# Altium project ov_ftdi.PrjPcb
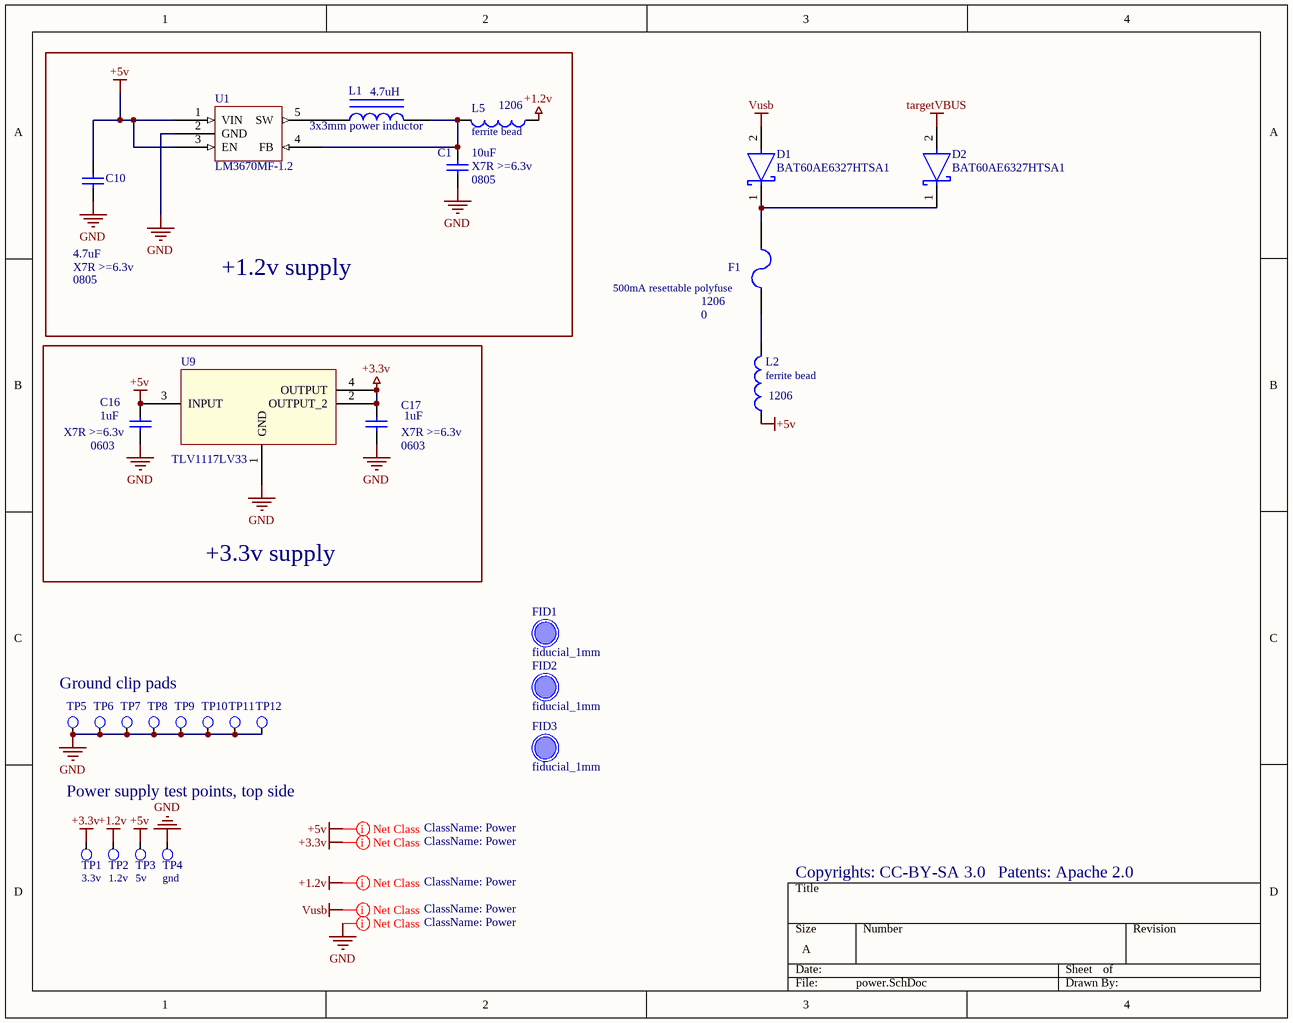
[diagram p0: power.SchDoc]
VersionRevision: v3.4; ProjectName: OpenVizsla
5 sheets, 167 parts. Net scope: global (net labels, ports and power ports of the same name join across sheets).
Board file: ov_ftdi.PcbDoc
Sheets:
  power.SchDoc
  FPGA power v3.SchDoc
  RAM and target USB.SchDoc
  fpga.SchDoc
  usb.SchDoc

## Sheet power.SchDoc
size A; DocumentNumber: 1; SheetNumber: 1; SheetTotal: 6

### Parts
C1  value 10uF  PackageReference: 0805  Rating: X7R >=6.3v  [CAPC2012N]  (hidden comment: Cap Semi)
C10  value 4.7uF  PackageReference: 0805  Rating: X7R >=6.3v  [CAPC2012N]  (hidden comment: Cap Semi)
C16  value 1uF  PackageReference: 0603  Rating: X7R >=6.3v  [CAPC1608N]  (hidden comment: Cap Semi)
C17  value 1uF  PackageReference: 0603  Rating: X7R >=6.3v  [CAPC1608N]  (hidden comment: Cap Semi)
D1  BAT60AE6327HTSA1  [FP-PG-SOD323-2-IPC_C]
D2  BAT60AE6327HTSA1  [FP-PG-SOD323-2-IPC_C]
F1  500mA resettable polyfuse  value 0  PackageReference: 1206  [RESC3216N]
FID1  fiducial_1mm  [Fiducial_1mm]
FID2  fiducial_1mm  [Fiducial_1mm]
FID3  fiducial_1mm  [Fiducial_1mm]
L1  3x3mm power inductor  value 4.7uH  [3x3mm inductor]
L2  ferrite bead  PackageReference: 1206  [INDC3216AN]
L5  ferrite bead  PackageReference: 1206  [INDC3216N]
TP1  3.3v  [testpoint-60mil]  (no BOM)
TP2  1.2v  [testpoint-60mil]  (no BOM)
TP3  5v  [testpoint-60mil]  (no BOM)
TP4  gnd  [testpoint-60mil]  (no BOM)
TP5  (no value)  [ground pad]  (no BOM)
TP6  (no value)  [ground pad]  (no BOM)
TP7  (no value)  [ground pad]  (no BOM)
TP8  (no value)  [ground pad]  (no BOM)
TP9  (no value)  [ground pad]  (no BOM)
TP10  (no value)  [ground pad]  (no BOM)
TP11  (no value)  [ground pad]  (no BOM)
TP12  (no value)  [ground pad]  (no BOM)
U1  value LM3670MF-1.2  [SOT23-5AN]  (hidden comment: LM3670MF-1.2/NOPB)
U9  TLV1117LV33  [DCY4]

### Blocks framed on the sheet
+1.2v supply: C1 C10 L1 L5 U1
+3.3v supply: C16 C17 U9

### Nets
+1.2v: L5.1 TP2.1(pin)
+3.3v: C17.2 TP1.1(pin) U9.2(OUTPUT_2) U9.4(OUTPUT)
+5v: C10.2 C16.2 L2.1 TP3.1(pin) U1.1(VIN) U1.3(EN) U9.3(INPUT)
GND: C1.1 C10.1 C16.1 C17.1 TP4.1(pin) TP5.1(pin) TP6.1(pin) TP7.1(pin) TP8.1(pin) TP9.1(pin) TP10.1(pin) TP11.1(pin) TP12.1(pin) U1.2(GND) U9.1(GND)
targetVBUS: D2.2(A)
Vusb: D1.2(A)
NetC1_2: C1.2 L1.2 L5.2 U1.4(FB)
NetD1_1: D1.1(C) D2.1(C) F1.1
NetF1_2: F1.2 L2.2
NetL1_1: L1.1 U1.5(SW)

### Layout directives
net class Power: +1.2v, +3.3v, +5v, GND, Vusb

### Notes on the sheet
- Ground clip pads
- Power supply test points, top side
- Copyrights: CC-BY-SA 3.0
- Patents: Apache 2.0
- Labels drawn without touching a wire or pin: +1.2v, +3.3v, +5v, GND, Vusb

### Library data of the parts
C1 = Cap Semi: Capacitor (Semiconductor SIM Model); Tolerance: ±10%; Substitutable: yes; Supplier 1: Mouser; Supplier Part Number 1: 81-GRM21BR61A106KE19
C10 = Cap: Capacitor; Tolerance: -20%, +80%; Substitutable: yes; Supplier 1: Digi-Key; Supplier Part Number 1: 445-1370-1-ND
C16 C17 = Cap Semi: Capacitor (Semiconductor SIM Model); Substitutable: yes; Supplier 1: Digi-Key; Supplier Part Number 1: 445-4703-1-ND
D1 D2 = CMP-32890-000004-1: DIODE SCHOTTKY 10V 3A SOD323-2; Forward Voltage: 370mV; Polarity: Standard; Peak Non-Repetitive Surge Current: 5A; Element Configuration: Single; Max Operating Temperature: 85°C; Current Rating: 3A; Number of Pins: 2; Mount: Surface Mount; Forward Current: 3A; Max Reverse Voltage (DC): 10V; Output Current: 3A; Contact Plating: Tin; Average Rectified Current: 3A; Lead Free: Lead Free; Max Repetitive Reverse Voltage (Vrrm): 10V; Voltage Rating (DC): 10V; Radiation Hardening: No; Halogen Free: Not Halogen Free; Case/Package: SOD-323-2; REACH SVHC: No SVHC; Min Operating Temperature: -55°C; Packaging: Tape and Reel
F1 = Fuse 2: Fuse; Substitutable: yes; Supplier 1: Mouser; Supplier Part Number 1: 576-1206L050YR
L1 = Inductor Iron: Magnetic-Core Inductor; Substitutable: yes; PackageReference: AXIAL-0.9; Supplier 1: Mouser; Supplier Part Number 1: 652-SRN3015-4R7M
L2 L5 = Inductor: VALUE: 0; Substitutable: yes; Supplier 1: Mouser; Supplier Part Number 1: 81-BLM18KG121TN1D
TP1-TP12 = Test Pad: PCB test point; Substitutable: DNP
U1 = LM3670: LM3670 buck step-down regulator, 350 mA; Substitutable: no; Supplier 1: Mouser; Supplier Part Number 1: 926-LM3670MF33NOPB; PackageReference: SOT23-5
U9 = TLV1117: Substitutable: no; Supplier 1: Digi-Key; Supplier Part Number 1: 296-28778-1-ND; PackageReference: SOT-223; Value: TLV1117LV33

## Sheet FPGA power v3.SchDoc
size A; DocumentNumber: 2; SheetNumber: 2; SheetTotal: 6
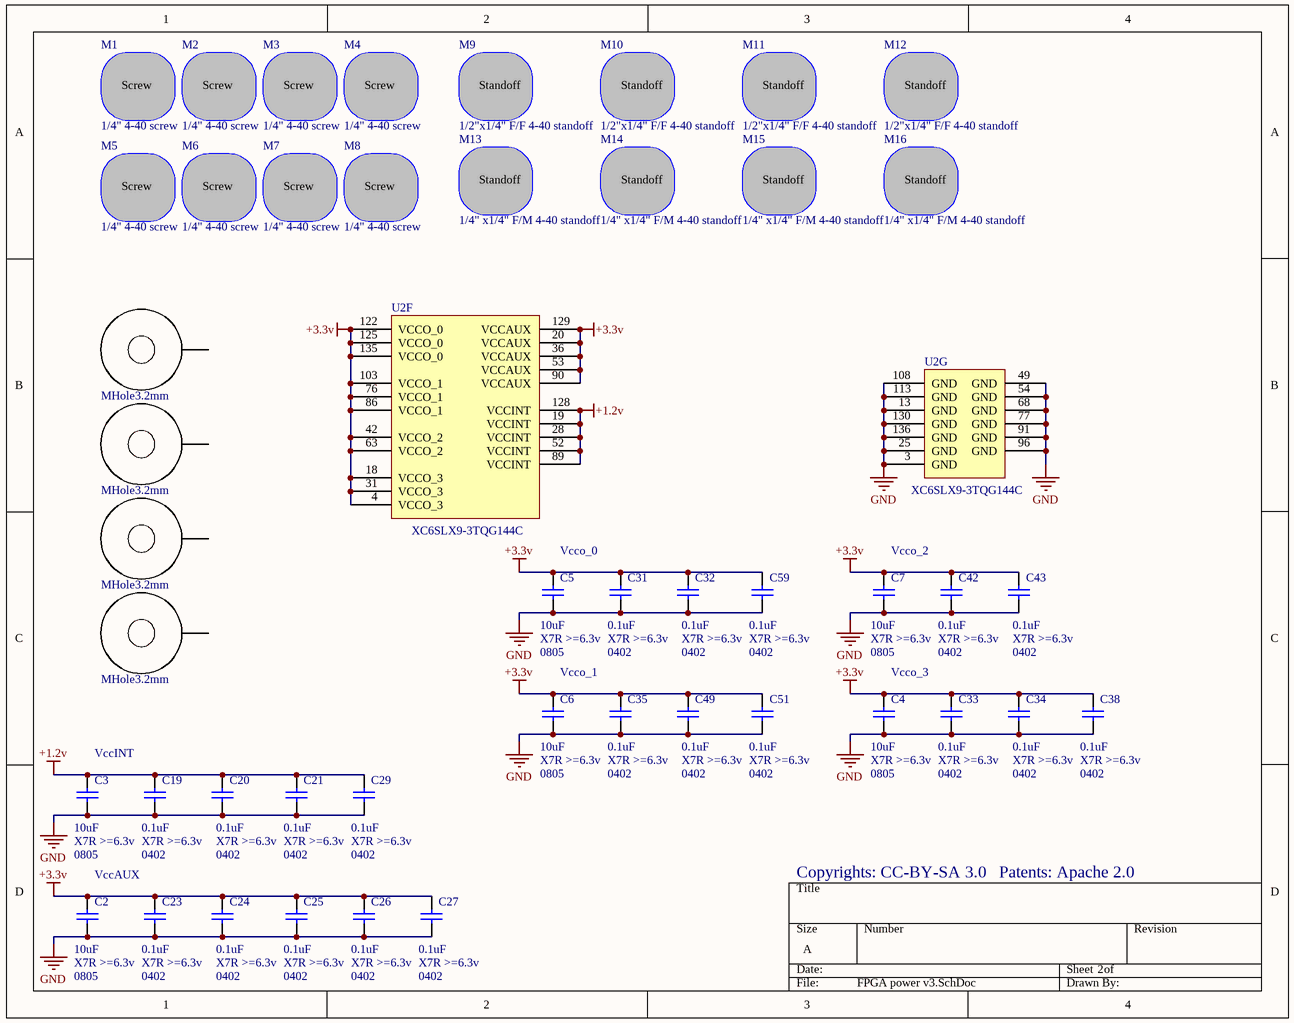
[diagram p1: FPGA power v3.SchDoc]

### Parts
C2  value 10uF  PackageReference: 0805  Rating: X7R >=6.3v  [CAPC2012N]  (hidden comment: Cap Semi)
C3  value 10uF  PackageReference: 0805  Rating: X7R >=6.3v  [CAPC2012N]  (hidden comment: Cap Semi)
C4  value 10uF  PackageReference: 0805  Rating: X7R >=6.3v  [CAPC2012N]  (hidden comment: Cap Semi)
C5  value 10uF  PackageReference: 0805  Rating: X7R >=6.3v  [CAPC2012N]  (hidden comment: Cap Semi)
C6  value 10uF  PackageReference: 0805  Rating: X7R >=6.3v  [CAPC2012N]  (hidden comment: Cap Semi)
C7  value 10uF  PackageReference: 0805  Rating: X7R >=6.3v  [CAPC2012N]  (hidden comment: Cap Semi)
C19  value 0.1uF  PackageReference: 0402  Rating: X7R >=6.3v  [CAPC1005N]  (hidden comment: Cap Semi)
C20  value 0.1uF  PackageReference: 0402  Rating: X7R >=6.3v  [CAPC1005N]  (hidden comment: Cap Semi)
C21  value 0.1uF  PackageReference: 0402  Rating: X7R >=6.3v  [CAPC1005N]  (hidden comment: Cap Semi)
C23  value 0.1uF  PackageReference: 0402  Rating: X7R >=6.3v  [CAPC1005N]  (hidden comment: Cap Semi)
C24  value 0.1uF  PackageReference: 0402  Rating: X7R >=6.3v  [CAPC1005N]  (hidden comment: Cap Semi)
C25  value 0.1uF  PackageReference: 0402  Rating: X7R >=6.3v  [CAPC1005N]  (hidden comment: Cap Semi)
C26  value 0.1uF  PackageReference: 0402  Rating: X7R >=6.3v  [CAPC1005N]  (hidden comment: Cap Semi)
C27  value 0.1uF  PackageReference: 0402  Rating: X7R >=6.3v  [CAPC1005N]  (hidden comment: Cap Semi)
C29  value 0.1uF  PackageReference: 0402  Rating: X7R >=6.3v  [CAPC1005N]  (hidden comment: Cap Semi)
C31  value 0.1uF  PackageReference: 0402  Rating: X7R >=6.3v  [CAPC1005N]  (hidden comment: Cap Semi)
C32  value 0.1uF  PackageReference: 0402  Rating: X7R >=6.3v  [CAPC1005N]  (hidden comment: Cap Semi)
C33  value 0.1uF  PackageReference: 0402  Rating: X7R >=6.3v  [CAPC1005N]  (hidden comment: Cap Semi)
C34  value 0.1uF  PackageReference: 0402  Rating: X7R >=6.3v  [CAPC1005N]  (hidden comment: Cap Semi)
C35  value 0.1uF  PackageReference: 0402  Rating: X7R >=6.3v  [CAPC1005N]  (hidden comment: Cap Semi)
C38  value 0.1uF  PackageReference: 0402  Rating: X7R >=6.3v  [CAPC1005N]  (hidden comment: Cap Semi)
C42  value 0.1uF  PackageReference: 0402  Rating: X7R >=6.3v  [CAPC1005N]  (hidden comment: Cap Semi)
C43  value 0.1uF  PackageReference: 0402  Rating: X7R >=6.3v  [CAPC1005N]  (hidden comment: Cap Semi)
C49  value 0.1uF  PackageReference: 0402  Rating: X7R >=6.3v  [CAPC1005N]  (hidden comment: Cap Semi)
C51  value 0.1uF  PackageReference: 0402  Rating: X7R >=6.3v  [CAPC1005N]  (hidden comment: Cap Semi)
C59  value 0.1uF  PackageReference: 0402  Rating: X7R >=6.3v  [CAPC1005N]  (hidden comment: Cap Semi)
H1  MHole3.2mm  [mounting hole]  (no BOM)
H2  MHole3.2mm  [mounting hole]  (no BOM)
H3  MHole3.2mm  [mounting hole]  (no BOM)
H4  MHole3.2mm  [mounting hole]  (no BOM)
M1  1/4" 4-40 screw  [fiducial]  (mechanical)
M2  1/4" 4-40 screw  [fiducial]  (mechanical)
M3  1/4" 4-40 screw  [fiducial]  (mechanical)
M4  1/4" 4-40 screw  [fiducial]  (mechanical)
M5  1/4" 4-40 screw  [fiducial]  (mechanical)
M6  1/4" 4-40 screw  [fiducial]  (mechanical)
M7  1/4" 4-40 screw  [fiducial]  (mechanical)
M8  1/4" 4-40 screw  [fiducial]  (mechanical)
M9  1/2"x1/4" F/F 4-40 standoff  [fiducial]  (mechanical)
M10  1/2"x1/4" F/F 4-40 standoff  [fiducial]  (mechanical)
M11  1/2"x1/4" F/F 4-40 standoff  [fiducial]  (mechanical)
M12  1/2"x1/4" F/F 4-40 standoff  [fiducial]  (mechanical)
M13  1/4" x1/4" F/M 4-40 standoff  [fiducial]  (mechanical)
M14  1/4" x1/4" F/M 4-40 standoff  [fiducial]  (mechanical)
M15  1/4" x1/4" F/M 4-40 standoff  [fiducial]  (mechanical)
M16  1/4" x1/4" F/M 4-40 standoff  [fiducial]  (mechanical)
U2  XC6SLX9-3TQG144C  [TQG144_N]  (parts F,G of 7)

### Nets
+1.2v: C3.2 C19.2 C20.2 C21.2 C29.2 U2.19(VCCINT) U2.28(VCCINT) U2.52(VCCINT) U2.89(VCCINT) U2.128(VCCINT)
+3.3v: C2.2 C4.2 C5.2 C6.2 C7.2 C23.2 C24.2 C25.2 C26.2 C27.2 C31.2 C32.2 C33.2 C34.2 C35.2 C38.2 C42.2 C43.2 C49.2 C51.2 C59.2 U2.4(VCCO_3) U2.18(VCCO_3) U2.20(VCCAUX) U2.31(VCCO_3) U2.36(VCCAUX) U2.42(VCCO_2) U2.53(VCCAUX) U2.63(VCCO_2) U2.76(VCCO_1) U2.86(VCCO_1) U2.90(VCCAUX) U2.103(VCCO_1) U2.122(VCCO_0) U2.125(VCCO_0) U2.129(VCCAUX) U2.135(VCCO_0)
GND: C2.1 C3.1 C4.1 C5.1 C6.1 C7.1 C19.1 C20.1 C21.1 C23.1 C24.1 C25.1 C26.1 C27.1 C29.1 C31.1 C32.1 C33.1 C34.1 C35.1 C38.1 C42.1 C43.1 C49.1 C51.1 C59.1 U2.3(GND) U2.13(GND) U2.25(GND) U2.49(GND) U2.54(GND) U2.68(GND) U2.77(GND) U2.91(GND) U2.96(GND) U2.108(GND) U2.113(GND) U2.130(GND) U2.136(GND)

Not connected (* = marked no-connect by the designer): H1 1; H2 1; H3 1; H4 1

### Notes on the sheet
- Vcco_0
- Vcco_2
- Vcco_1
- Vcco_3
- VccINT
- VccAUX
- Copyrights: CC-BY-SA 3.0
- Patents: Apache 2.0

### Library data of the parts
C2-C7 C19-C21 C23-C27 C29 C31-C35 C38 C42 C43 C49 C51 C59 = Cap Semi: Capacitor (Semiconductor SIM Model); Description: CAP CER 0.1UF 25V 10% X5R 0603; Tolerance: ±10%; Substitutable: yes
  C2-C7: Supplier 1: Mouser; Supplier Part Number 1: 81-GRM21BR61A106KE19
  C19-C21 C23-C27 C29 C31-C35 C38 C42 C43 C49 C51 C59: Supplier 1: Digi-Key; Supplier Part Number 1: 445-4703-1-ND; Supplier 2: Digi-Key; Supplier Part Number 2: 445-6854-1-ND
H1-H4 = 22898: Substitutable: DNP
M1-M8 = Screw: DigiKey Link: http://www.digikey.com/product-detail/en/PMSSS%20440%200025%20PH/H703-ND/274914; DigiKey Price/100: 0.0564; Mouser Link: https://www.mouser.com/Search/ProductDetail.aspx?R=9900virtualkey53400000virtualkey534-9900; Mouser Price/100: 0.06
M9-M12 = Standoff: DigiKey Link: http://www.digikey.com/product-detail/en/2203/2203K-ND/82512; DigiKey Price/100: 0.296; Mouser Link: https://www.mouser.com/Search/ProductDetail.aspx?R=2104-440-AL-7virtualkey68520000virtualkey761-2104-440-AL-7; Mouser Price/100: 0.19
M13-M16 = Standoff: 1/4"x1/4" F/M 4-40 standof; DigiKey Link: http://www.digikey.com/product-search/en?mpart=8714&vendor=36; DigiKey Price/100: 0.278; Mouser Link: https://www.mouser.com/Search/ProductDetail.aspx?R=8714virtualkey53400000virtualkey534-8714; Mouser Price/100: 0,281
U2 = XC6SLX9-3TQG144C: Spartan-6 LX 1.2V FPGA, 102 User I/Os, 144-Pin TQFP (0.5mm Pitch), Speed Grade 3, Commercial Grade, Pb-Free; Substitutable: no; PackageReference: TQG144; Value: XC6SLX9-3TQG144C

## Sheet RAM and target USB.SchDoc
size A; DocumentNumber: 3; SheetNumber: 3; SheetTotal: 6
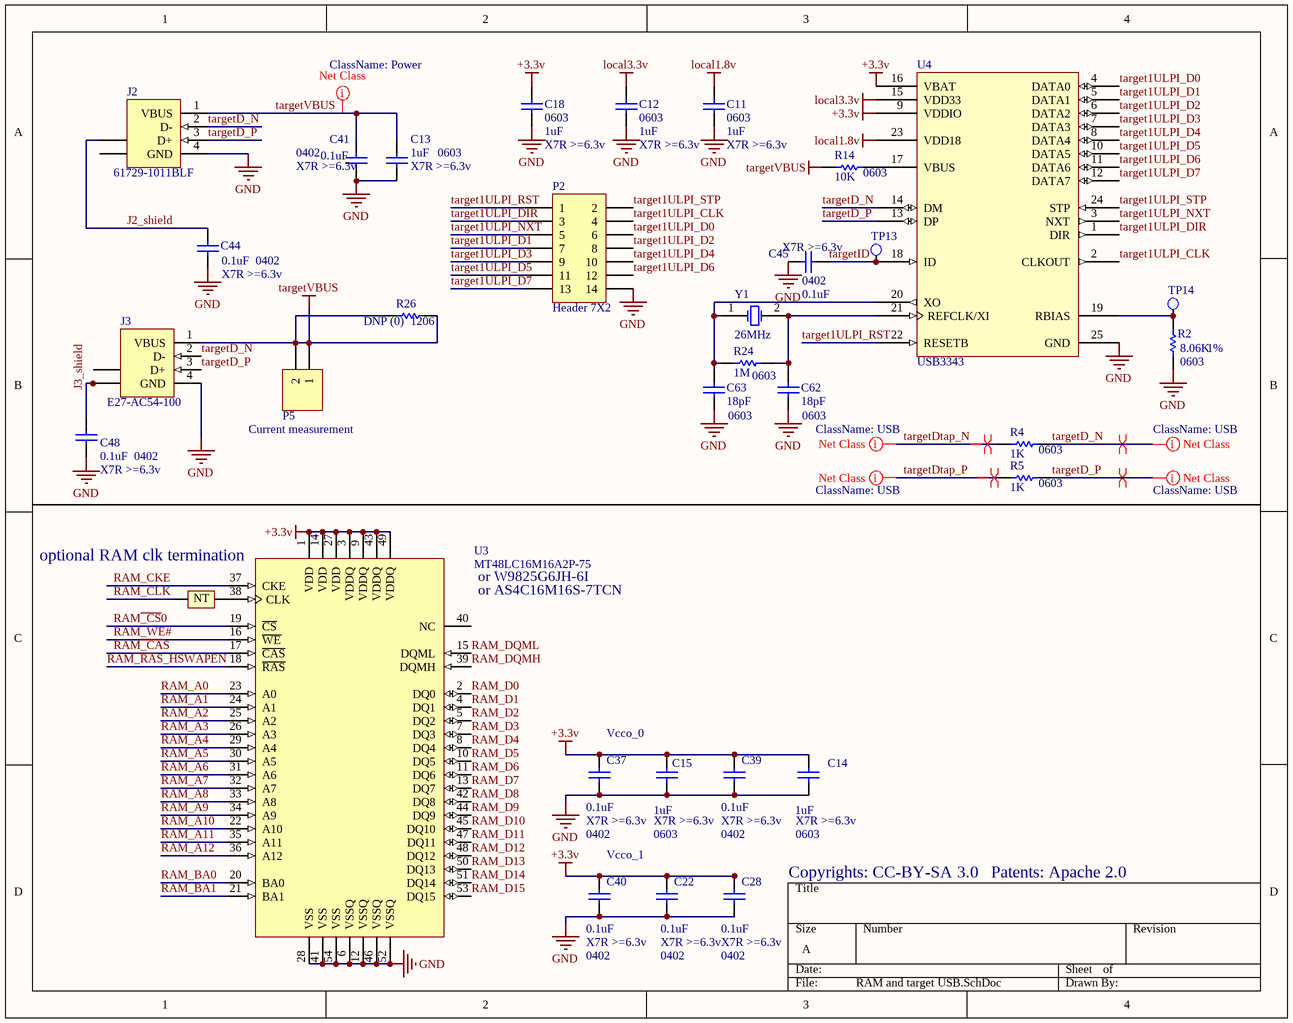
[diagram p2: RAM and target USB.SchDoc]

### Parts
C11  value 1uF  PackageReference: 0603  Rating: X7R >=6.3v  [CAPC1608N]  (hidden comment: Cap Semi)
C12  value 1uF  PackageReference: 0603  Rating: X7R >=6.3v  [CAPC1608N]  (hidden comment: Cap Semi)
C13  value 1uF  PackageReference: 0603  Rating: X7R >=6.3v  [CAPC1608N]  (hidden comment: Cap Semi)
C14  value 1uF  PackageReference: 0603  Rating: X7R >=6.3v  [CAPC1608N]  (hidden comment: Cap Semi)
C15  value 1uF  PackageReference: 0603  Rating: X7R >=6.3v  [CAPC1608N]  (hidden comment: Cap Semi)
C18  value 1uF  PackageReference: 0603  Rating: X7R >=6.3v  [CAPC1608N]  (hidden comment: Cap Semi)
C22  value 0.1uF  PackageReference: 0402  Rating: X7R >=6.3v  [CAPC1005N]  (hidden comment: Cap Semi)
C28  value 0.1uF  PackageReference: 0402  Rating: X7R >=6.3v  [CAPC1005N]  (hidden comment: Cap Semi)
C37  value 0.1uF  PackageReference: 0402  Rating: X7R >=6.3v  [CAPC1005N]  (hidden comment: Cap Semi)
C39  value 0.1uF  PackageReference: 0402  Rating: X7R >=6.3v  [CAPC1005N]  (hidden comment: Cap Semi)
C40  value 0.1uF  PackageReference: 0402  Rating: X7R >=6.3v  [CAPC1005N]  (hidden comment: Cap Semi)
C41  value 0.1uF  PackageReference: 0402  Rating: X7R >=6.3v  [CAPC1005N]  (hidden comment: Cap Semi)
C44  value 0.1uF  PackageReference: 0402  Rating: X7R >=6.3v  [CAPC1005N]  (hidden comment: Cap Semi)
C45  value 0.1uF  PackageReference: 0402  Rating: X7R >=6.3v  [CAPC1005N]  (hidden comment: Cap Semi)
C48  value 0.1uF  PackageReference: 0402  Rating: X7R >=6.3v  [CAPC1005N]  (hidden comment: Cap Semi)
C62  value 18pF  PackageReference: 0603  [CAPC1608N]  (hidden comment: Cap Semi)
C63  value 18pF  PackageReference: 0603  [CAPC1608N]  (hidden comment: Cap Semi)
J2  value 61729-1011BLF  [1-1470156]  (hidden comment: 1-1470156-1)
J3  value E27-AC54-100  [787616]  (hidden comment: 787616-1)
NT1  Net Tie2  [NetTie 0603]  (value not drawn)  (net tie, no BOM)
P2  Header 7X2  [HDR2X7]  (no BOM)
P5  Current measurement  [HDR1X2]  (no BOM)
R2  value 8.06K  PackageReference: 0603  Rating: 1%  [RESC1608N]  (hidden comment: Res Semi)
R4  value 1K  PackageReference: 0603  [RESC1608N]  (hidden comment: Res Semi)
R5  value 1K  PackageReference: 0603  [RESC1608N]  (hidden comment: Res Semi)
R14  value 10K  PackageReference: 0603  [RESC1608N]  (hidden comment: Res Semi)
R24  value 1M  PackageReference: 0603  [RESC1608N]  (hidden comment: Res Semi)
R26  value DNP (0)  PackageReference: 1206  [RESC3216N]  (hidden comment: Res Semi)
TP13  Test Point  [testpoint]  (value not drawn)  (no BOM)
TP14  Test Point  [testpoint]  (value not drawn)  (no BOM)
U3  MT48LC16M16A2P-75  [TSOP2-54_N]
U4  USB3343  [SMSC USB334x QFN24]
Y1  26MHz  [HC49/4H_SMX]

### Nets
+3.3v: C14.2 C15.2 C18.1 C22.2 C28.2 C37.2 C39.2 C40.2 U3.1(VDD) U3.3(VDDQ) U3.9(VDDQ) U3.14(VDD) U3.27(VDD) U3.43(VDDQ) U3.49(VDDQ) U4.9(VDDIO) U4.16(VBAT)
GND: C11.2 C12.2 C13.1 C14.1 C15.1 C18.2 C22.1 C28.1 C37.1 C39.1 C40.1 C41.1 C44.1 C45.2 C48.1 C62.1 C63.1 J2.4(GND) J3.4(GND) P2.14 R2.1 U3.6(VSSQ) U3.12(VSSQ) U3.28(VSS) U3.41(VSS) U3.46(VSSQ) U3.52(VSSQ) U3.54(VSS) U4.25(GND)
local1.8v: C11.1 U4.23(VDD18)
local3.3v: C12.1 U4.15(VDD33)
targetVBUS: C13.2 C41.2 J2.1(VBUS) J3.1(VBUS) P5.1 P5.2 R14.2 R26.1 R26.2
J2_shield: C44.2 J2.5(SHLD)
J3_shield: C48.2 J3.6(SHLD)
RAM~{_CA}S: U3.17(~{CAS})
RAM~{_CS}0: U3.19(~{CS})
RAM~{_RA}S_HSWAPEN: U3.18(~{RAS})
RAM_A0: U3.23(A0)
RAM_A1: U3.24(A1)
RAM_A2: U3.25(A2)
RAM_A3: U3.26(A3)
RAM_A4: U3.29(A4)
RAM_A5: U3.30(A5)
RAM_A6: U3.31(A6)
RAM_A7: U3.32(A7)
RAM_A8: U3.33(A8)
RAM_A9: U3.34(A9)
RAM_A10: U3.22(A10)
RAM_A11: U3.35(A11)
RAM_A12: U3.36(A12)
RAM_BA0: U3.20(BA0)
RAM_BA1: U3.21(BA1)
RAM_CKE: U3.37(CKE)
RAM_CLK: NT1.1
RAM_D0: U3.2(DQ0)
RAM_D1: U3.4(DQ1)
RAM_D2: U3.5(DQ2)
RAM_D3: U3.7(DQ3)
RAM_D4: U3.8(DQ4)
RAM_D5: U3.10(DQ5)
RAM_D6: U3.11(DQ6)
RAM_D7: U3.13(DQ7)
RAM_D8: U3.42(DQ8)
RAM_D9: U3.44(DQ9)
RAM_D10: U3.45(DQ10)
RAM_D11: U3.47(DQ11)
RAM_D12: U3.48(DQ12)
RAM_D13: U3.50(DQ13)
RAM_D14: U3.51(DQ14)
RAM_D15: U3.53(DQ15)
RAM_DQMH: U3.39(DQMH)
RAM_DQML: U3.15(DQML)
RAM_WE#: U3.16(~{WE})
target1ULPI_CLK: P2.4 U4.2(CLKOUT)
target1ULPI_D0: P2.6 U4.4(DATA0)
target1ULPI_D1: P2.7 U4.5(DATA1)
target1ULPI_D2: P2.8 U4.6(DATA2)
target1ULPI_D3: P2.9 U4.7(DATA3)
target1ULPI_D4: P2.10 U4.8(DATA4)
target1ULPI_D5: P2.11 U4.10(DATA5)
target1ULPI_D6: P2.12 U4.11(DATA6)
target1ULPI_D7: P2.13 U4.12(DATA7)
target1ULPI_DIR: P2.3 U4.1(DIR)
target1ULPI_NXT: P2.5 U4.3(NXT)
target1ULPI_RST: P2.1 U4.22(RESETB)
target1ULPI_STP: P2.2 U4.24(STP)
targetD_N: J2.2(D-) J3.2(D-) R4.1 U4.14(DM)
targetD_P: J2.3(D+) J3.3(D+) R5.1 U4.13(DP)
targetDtap_N: R4.2
targetDtap_P: R5.2
targetID: C45.1 TP13.1(pin) U4.18(ID)
NetC62_2: C62.2 R24.1 U4.21(REFCLK/XI) Y1.2(OSC2)
NetC63_2: C63.2 R24.2 U4.20(XO) Y1.1(OSC1)
NetNT1_2: NT1.2 U3.38(CLK)
NetR2_2: R2.2 TP14.1(pin) U4.19(RBIAS)
NetR14_1: R14.1 U4.17(VBUS)

Not connected (* = marked no-connect by the designer): J2 6(SHLD); J3 5(SHLD); U3 40(NC)

### Layout directives
net class Power: targetVBUS
differential pair: targetD_N, targetD_P, targetDtap_N, targetDtap_P
net class USB: targetD_N, targetD_P, targetDtap_N, targetDtap_P

### Notes on the sheet
- (near U3) optional RAM clk termination
- (near U3) or W9825G6JH-6I
- (near U3) or AS4C16M16S-7TCN
- Vcco_0
- Vcco_1
- Copyrights: CC-BY-SA 3.0
- Patents: Apache 2.0
- (in symbol Net Tie2) NT

### Library data of the parts
C11 C12 C18 = Cap Semi: Capacitor (Semiconductor SIM Model); Substitutable: yes; Description: CAP CER 10000PF 6.3V X5R 0201; Tolerance: ±10%; Supplier 1: Digi-Key; Supplier Part Number 1: 445-4703-1-ND
C13-C15 = Cap Semi: as C16 on sheet power; Supplier 1: Digi-Key; Supplier Part Number 1: 445-4703-1-ND
C22 C28 C40 = Cap Semi: as C2 on sheet FPGA power v3; Supplier 1: Digi-Key; Supplier Part Number 1: 445-4703-1-ND; Supplier 2: Digi-Key; Supplier Part Number 2: 445-6854-1-ND
C37 C39 C41 C44 C45 C48 = Cap Semi: Capacitor (Semiconductor SIM Model); Substitutable: yes; Tolerance: ±10%; Supplier 1: Digi-Key; Supplier Part Number 1: 445-4703-1-ND; Supplier 2: Digi-Key; Supplier Part Number 2: 445-6854-1-ND
C62 C63 = Cap Semi: Capacitor (Semiconductor SIM Model); Rating: C0G >=6.3v; Substitutable: yes; Supplier 1: Digi-Key; Supplier Part Number 1: 445-1777-1-ND
J2 = 1-1470156-1: USB 1.1, Right Angle, Thru-Hole, B Type, Receptacle, 4 Position, White; Substitutable: no; PackageReference: 1-1470156
J3 = 787616-1: USB 1.1, Right Angle, Thru-Hole, A Type, Receptacle, 4 Position, Black; Substitutable: no
NT1 = Net Tie2: 0603 Net Tie to connect 2 different nets; Substitutable: DNP
P2 = Header 7X2: Header, 7-Pin, Dual row; Substitutable: DNP
P5 = Header 2: Header, 2-Pin; Substitutable: DNP
R2 = Res Semi: Semiconductor Resistor; Substitutable: yes; Supplier 1: Digi-Key; Supplier Part Number 1: 311-8.06KHRCT-ND
R4 R5 R14 R24 R26 = Res Semi: Semiconductor Resistor; Rating: 5%; Substitutable: yes
TP13 TP14 = Test Pad: Substitutable: DNP
U3 = MT48LC16M16A2P-75: 256Mb Synchronous High-Speed CMOS DRAM, 16Mb x 16Bit x 4 Banks, 54-Pin TSOP Pb-free, Commercial; Substitutable: no; PackageReference: TSOP2-54; Value: MT48LC16M16A2P-75; Supplier 1: Digi-Key; Supplier Part Number 1: 557-1059-1-ND; Supplier 2: Arrow; Supplier Part Number 2: 41315055S7057620N2406
U4 = USB3343: Hi-Speed USB Transceiver with 1.8V-3.3V ULPI Interface - MHz Reference Clock; Substitutable: no; PackageReference: QFN-24; Value: USB3343
Y1 = XTAL: Crystal Oscillator; Substitutable: yes; PackageReference: HS-49; Value: 26 MHz

## Sheet fpga.SchDoc
size A; DocumentNumber: 5; SheetNumber: 5; SheetTotal: 6
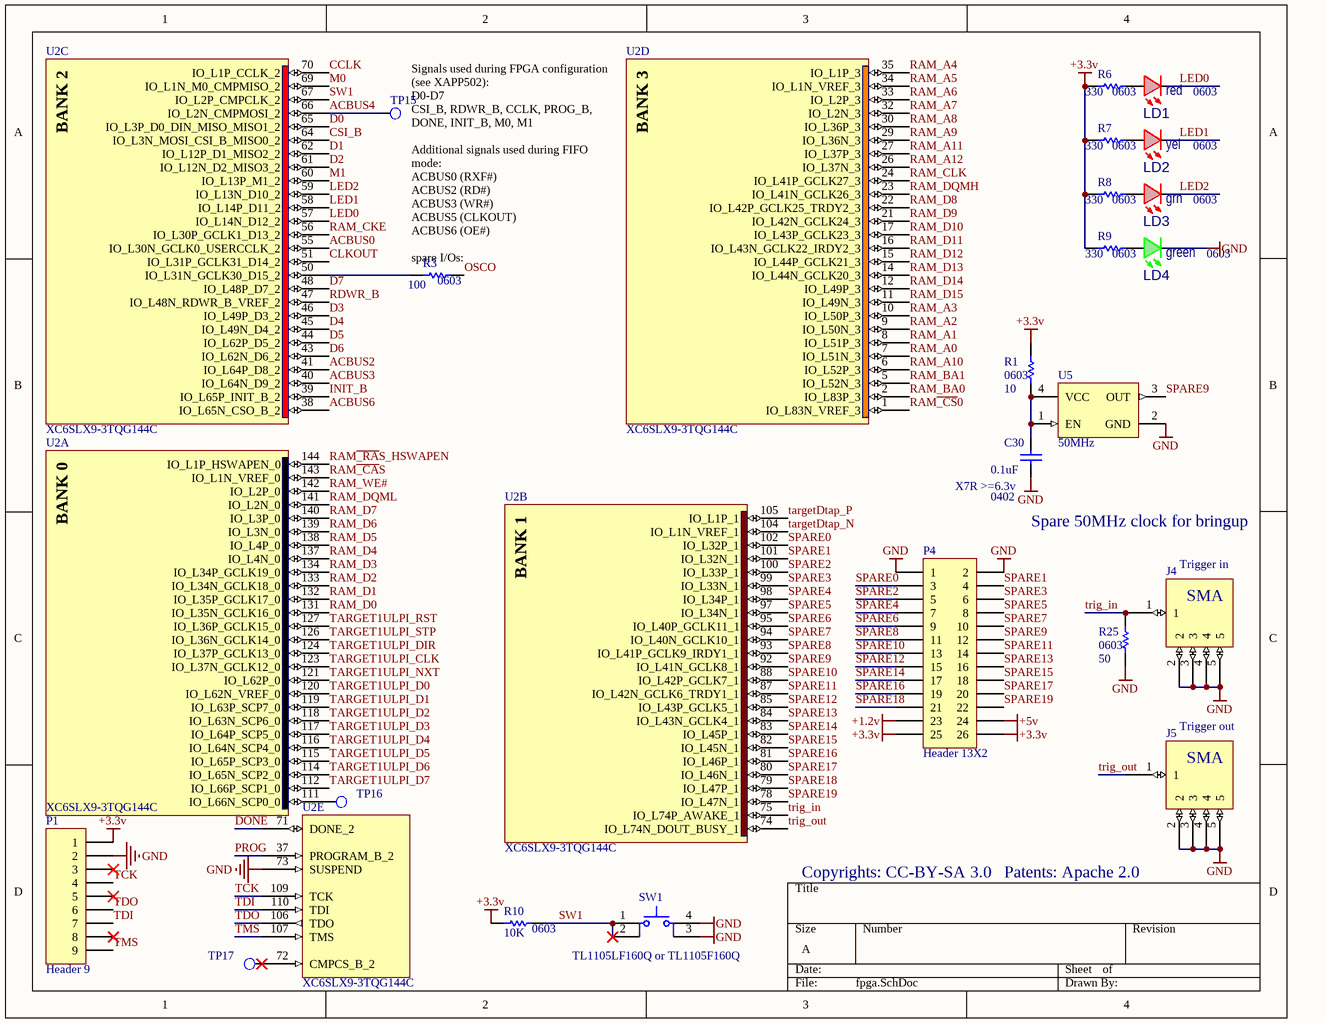
[diagram p3: fpga.SchDoc]

### Parts
C30  value 0.1uF  PackageReference: 0402  Rating: X7R >=6.3v  [CAPC1005N]  (hidden comment: Cap Semi)
J4  Trigger in  [EMPCB.SMAFSTJ.C.HT]
J5  Trigger out  [EMPCB.SMAFSTJ.C.HT]
LD1  value red  PackageReference: 0603  [LED 0603]  (hidden comment: RED-LED)
LD2  value yel  PackageReference: 0603  [LED 0603]  (hidden comment: RED-LED)
LD3  value grn  PackageReference: 0603  [LED 0603]  (hidden comment: RED-LED)
LD4  value green  PackageReference: 0603  [LED 0603]  (hidden comment: GREEN-LED)
P1  Header 9  [HDR1X9]  (no BOM)
P4  Header 13X2  [HDR2X13]
R1  value 10  PackageReference: 0603  [RESC1608N]  (hidden comment: Res Semi)
R3  value 100  PackageReference: 0603  [RESC1608N]  (hidden comment: Res Semi)
R6  value 330  PackageReference: 0603  [RESC1608N]  (hidden comment: Res Semi)
R7  value 330  PackageReference: 0603  [RESC1608N]  (hidden comment: Res Semi)
R8  value 330  PackageReference: 0603  [RESC1608N]  (hidden comment: Res Semi)
R9  value 330  PackageReference: 0603  [RESC1608N]  (hidden comment: Res Semi)
R10  value 10K  PackageReference: 0603  [RESC1608N]  (hidden comment: Res Semi)
R25  value 50  PackageReference: 0603  [RESC1608N]  (hidden comment: Res Semi)
SW1  value TL1105LF160Q or TL1105F160Q  [TL1105]  (hidden comment: 4pin button)
TP15  Test Point  [testpoint]  (value not drawn)  (no BOM)
TP16  Test Point  [testpoint]  (value not drawn)  (no BOM)
TP17  Test Point  [testpoint]  (value not drawn)  (no BOM)
U2  XC6SLX9-3TQG144C  [TQG144_N]  (parts A,B,C,D,E of 7)
U5  value 50MHz  [ASEMB 3.2x2.5 oscillator]

### Nets
+1.2v: P4.23
+3.3v: P1.1 P4.25 P4.26 R1.1 R6.2 R7.2 R8.2 R9.2 R10.2
+5v: P4.24
GND: C30.1 J4.2 J4.3 J4.4 J4.5 J5.2 J5.3 J5.4 J5.5 LD4.C(C-) P1.2 P4.1 P4.2 R25.2 SW1.3 SW1.4 U2.73(SUSPEND) U5.2(GND)
ACBUS0: U2.55(IO_L30N_GCLK0_USERCCLK_2)
ACBUS2: U2.41(IO_L64P_D8_2)
ACBUS3: U2.40(IO_L64N_D9_2)
ACBUS4: TP15.1(pin) U2.66(IO_L2N_CMPMOSI_2)
ACBUS6: U2.38(IO_L65N_CSO_B_2)
CCLK: U2.70(IO_L1P_CCLK_2)
CLKOUT: U2.51(IO_L31P_GCLK31_D14_2)
CSI_B: U2.64(IO_L3N_MOSI_CSI_B_MISO0_2)
D0: U2.65(IO_L3P_D0_DIN_MISO_MISO1_2)
D1: U2.62(IO_L12P_D1_MISO2_2)
D2: U2.61(IO_L12N_D2_MISO3_2)
D3: U2.46(IO_L49P_D3_2)
D4: U2.45(IO_L49N_D4_2)
D5: U2.44(IO_L62P_D5_2)
D6: U2.43(IO_L62N_D6_2)
D7: U2.48(IO_L48P_D7_2)
DONE: U2.71(DONE_2)
INIT_B: U2.39(IO_L65P_INIT_B_2)
LED0: LD1.C(C-) U2.57(IO_L14N_D12_2)
LED1: LD2.C(C-) U2.58(IO_L14P_D11_2)
LED2: LD3.C(C-) U2.59(IO_L13N_D10_2)
M0: U2.69(IO_L1N_M0_CMPMISO_2)
M1: U2.60(IO_L13P_M1_2)
OSCO: R3.1
PROG: U2.37(PROGRAM_B_2)
RAM~{_CA}S: U2.143(IO_L1N_VREF_0)
RAM~{_CS}0: U2.1(IO_L83N_VREF_3)
RAM~{_RA}S_HSWAPEN: U2.144(IO_L1P_HSWAPEN_0)
RAM_A0: U2.7(IO_L51N_3)
RAM_A1: U2.8(IO_L51P_3)
RAM_A2: U2.9(IO_L50N_3)
RAM_A3: U2.10(IO_L50P_3)
RAM_A4: U2.35(IO_L1P_3)
RAM_A5: U2.34(IO_L1N_VREF_3)
RAM_A6: U2.33(IO_L2P_3)
RAM_A7: U2.32(IO_L2N_3)
RAM_A8: U2.30(IO_L36P_3)
RAM_A9: U2.29(IO_L36N_3)
RAM_A10: U2.6(IO_L52P_3)
RAM_A11: U2.27(IO_L37P_3)
RAM_A12: U2.26(IO_L37N_3)
RAM_BA0: U2.2(IO_L83P_3)
RAM_BA1: U2.5(IO_L52N_3)
RAM_CKE: U2.56(IO_L30P_GCLK1_D13_2)
RAM_CLK: U2.24(IO_L41P_GCLK27_3)
RAM_D0: U2.131(IO_L35N_GCLK16_0)
RAM_D1: U2.132(IO_L35P_GCLK17_0)
RAM_D2: U2.133(IO_L34N_GCLK18_0)
RAM_D3: U2.134(IO_L34P_GCLK19_0)
RAM_D4: U2.137(IO_L4N_0)
RAM_D5: U2.138(IO_L4P_0)
RAM_D6: U2.139(IO_L3N_0)
RAM_D7: U2.140(IO_L3P_0)
RAM_D8: U2.22(IO_L42P_GCLK25_TRDY2_3)
RAM_D9: U2.21(IO_L42N_GCLK24_3)
RAM_D10: U2.17(IO_L43P_GCLK23_3)
RAM_D11: U2.16(IO_L43N_GCLK22_IRDY2_3)
RAM_D12: U2.15(IO_L44P_GCLK21_3)
RAM_D13: U2.14(IO_L44N_GCLK20_3)
RAM_D14: U2.12(IO_L49P_3)
RAM_D15: U2.11(IO_L49N_3)
RAM_DQMH: U2.23(IO_L41N_GCLK26_3)
RAM_DQML: U2.141(IO_L2N_0)
RAM_WE#: U2.142(IO_L2P_0)
RDWR_B: U2.47(IO_L48N_RDWR_B_VREF_2)
SPARE0: P4.3 U2.102(IO_L32P_1)
SPARE1: P4.4 U2.101(IO_L32N_1)
SPARE2: P4.5 U2.100(IO_L33P_1)
SPARE3: P4.6 U2.99(IO_L33N_1)
SPARE4: P4.7 U2.98(IO_L34P_1)
SPARE5: P4.8 U2.97(IO_L34N_1)
SPARE6: P4.9 U2.95(IO_L40P_GCLK11_1)
SPARE7: P4.10 U2.94(IO_L40N_GCLK10_1)
SPARE8: P4.11 U2.93(IO_L41P_GCLK9_IRDY1_1)
SPARE9: P4.12 U2.92(IO_L41N_GCLK8_1) U5.3(OUT)
SPARE10: P4.13 U2.88(IO_L42P_GCLK7_1)
SPARE11: P4.14 U2.87(IO_L42N_GCLK6_TRDY1_1)
SPARE12: P4.15 U2.85(IO_L43P_GCLK5_1)
SPARE13: P4.16 U2.84(IO_L43N_GCLK4_1)
SPARE14: P4.17 U2.83(IO_L45P_1)
SPARE15: P4.18 U2.82(IO_L45N_1)
SPARE16: P4.19 U2.81(IO_L46P_1)
SPARE17: P4.20 U2.80(IO_L46N_1)
SPARE18: P4.21 U2.79(IO_L47P_1)
SPARE19: P4.22 U2.78(IO_L47N_1)
SW1: R10.1 SW1.1 SW1.2 U2.67(IO_L2P_CMPCLK_2)
target1ULPI_CLK: U2.123(IO_L37N_GCLK12_0)
target1ULPI_D0: U2.120(IO_L62N_VREF_0)
target1ULPI_D1: U2.119(IO_L63P_SCP7_0)
target1ULPI_D2: U2.118(IO_L63N_SCP6_0)
target1ULPI_D3: U2.117(IO_L64P_SCP5_0)
target1ULPI_D4: U2.116(IO_L64N_SCP4_0)
target1ULPI_D5: U2.115(IO_L65P_SCP3_0)
target1ULPI_D6: U2.114(IO_L65N_SCP2_0)
target1ULPI_D7: U2.112(IO_L66P_SCP1_0)
target1ULPI_DIR: U2.124(IO_L37P_GCLK13_0)
target1ULPI_NXT: U2.121(IO_L62P_0)
target1ULPI_RST: U2.127(IO_L36P_GCLK15_0)
target1ULPI_STP: U2.126(IO_L36N_GCLK14_0)
targetDtap_N: U2.104(IO_L1N_VREF_1)
targetDtap_P: U2.105(IO_L1P_1)
TCK: P1.4 U2.109(TCK)
TDI: P1.7 U2.110(TDI)
TDO: P1.6 U2.106(TDO)
TMS: P1.9 U2.107(TMS)
trig_in: J4.1 R25.1 U2.75(IO_L74P_AWAKE_1)
trig_out: J5.1 U2.74(IO_L74N_DOUT_BUSY_1)
NetC30_2: C30.2 R1.2 U5.1(EN) U5.4(VCC)
NetLD1_A: LD1.A(A+) R6.1
NetLD2_A: LD2.A(A+) R7.1
NetLD3_A: LD3.A(A+) R8.1
NetLD4_A: LD4.A(A+) R9.1
NetR3_2: R3.2 U2.50(IO_L31N_GCLK30_D15_2)
NetTP16_1: TP16.1(pin) U2.111(IO_L66N_SCP0_0)
NetTP17_1: TP17.1(pin) U2.72(CMPCS_B_2)

Not connected (* = marked no-connect by the designer): P1 3* 5* 8*

### Notes on the sheet
- Signals used during FPGA configuration (see XAPP502):
  D0-D7
  CSI_B, RDWR_B, CCLK, PROG_B, DONE, INIT_B, M0, M1
  Additional signals used during FIFO mode:
  ACBUS0 (RXF#)
  ACBUS2 (RD#)
  ACBUS3 (WR#)
  ACBUS5 (CLKOUT)
  ACBUS6 (OE#)
  spare I/Os:
- Spare 50MHz clock for bringup
- Copyrights: CC-BY-SA 3.0
- Patents: Apache 2.0
- (in symbol EMPCB.SMAFSTJ.C.HT) SMA
- (in symbol XC6SLX9-3TQG144C, part A) BANK 0
- (in symbol XC6SLX9-3TQG144C, part B) BANK 1
- (in symbol XC6SLX9-3TQG144C, part C) BANK 2
- (in symbol XC6SLX9-3TQG144C, part D) BANK 3

### Library data of the parts
C30 = Cap Semi: as C2 on sheet FPGA power v3; Supplier 1: Digi-Key; Supplier Part Number 1: 445-4703-1-ND; Supplier 2: Digi-Key; Supplier Part Number 2: 445-6854-1-ND
J4 J5 = EMPCB.SMAFSTJ.C.HT: PCB edge mount SMA jack
LD1-LD3 = RED-LED-SMD: Substitutable: yes; Supplier 1: Mouser; Supplier Part Number 1: 755-SML-310VTT86
LD4 = GREEN-LED-SMD: Substitutable: yes; Supplier 1: Mouser; Supplier Part Number 1: 645-598-8060-107F
P1 = Header 9: Header, 9-Pin; Substitutable: DNP
P4 = Header 13X2: Header, 13-Pin, Dual row; LatestRevisionDate: 17-Jul-2002; LatestRevisionNote: Re-released for DXP Platform.; Publisher: Altium Limited
R1 R3 R6-R10 R25 = Res Semi: as R4 on sheet RAM and target USB
SW1 = KMS221G_LFS: Substitutable: no; Supplier 1: Mouser; Supplier Part Number 1: 612-TL1105LF; PackageReference: 4-pin thu-hole
TP15-TP17 = Test Pad: Substitutable: DNP
U2 = XC6SLX9-3TQG144C: as U2 on sheet FPGA power v3; PackageReference: TQG144; Value: XC6SLX9-3TQG144C
U5 = OSC-4P: Oscillator; Substitutable: no; PackageReference: 3.2x2.5

## Sheet usb.SchDoc
size A; DocumentNumber: 6; SheetNumber: 6; SheetTotal: 6
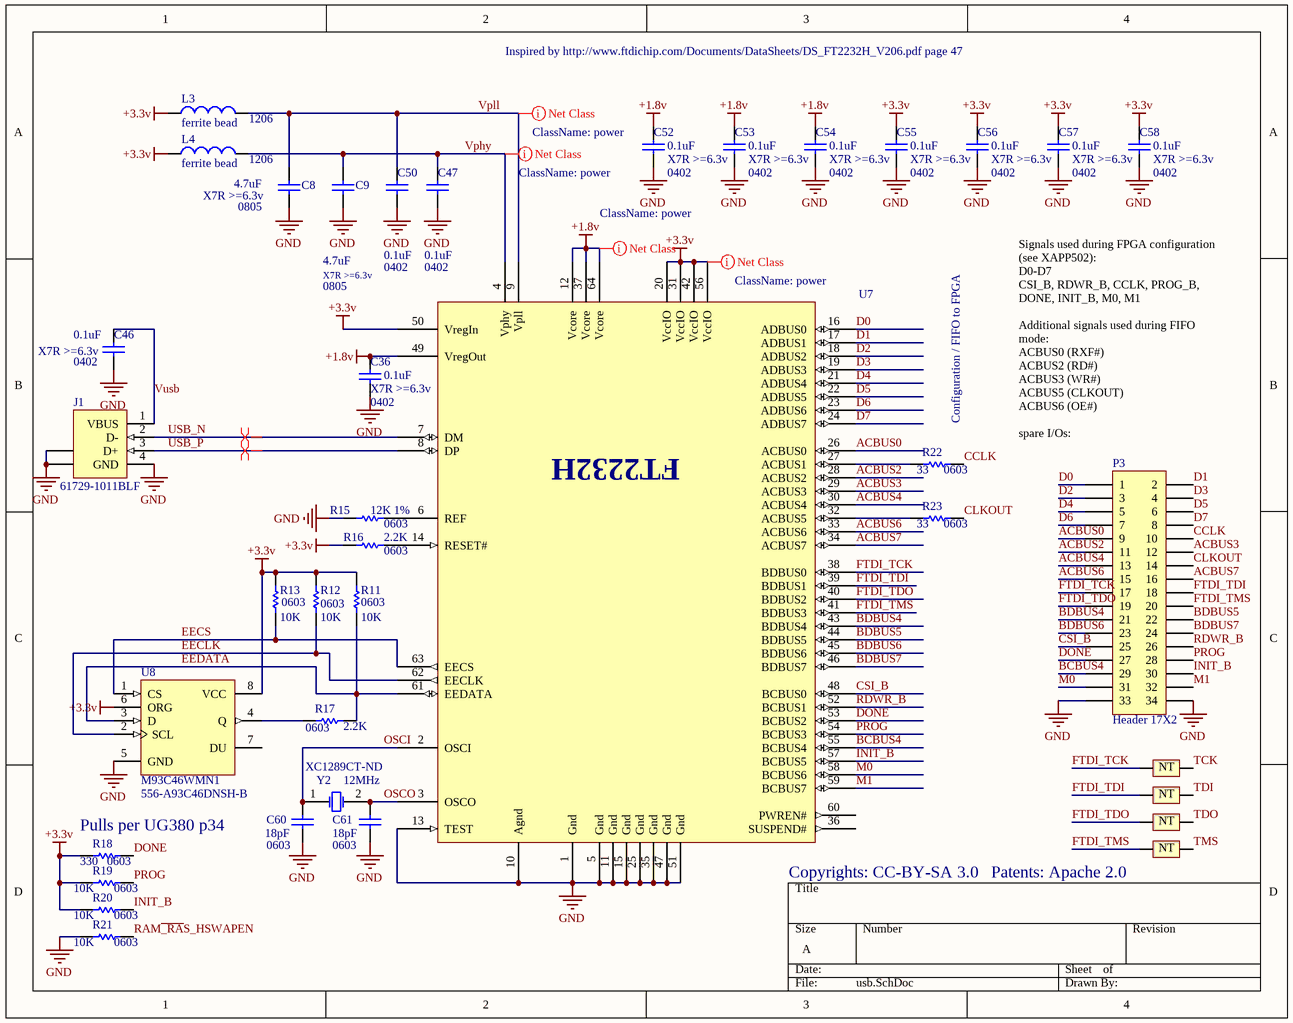
[diagram p4: usb.SchDoc]

### Parts
C8  value 4.7uF  PackageReference: 0805  Rating: X7R >=6.3v  [CAPC2012N]  (hidden comment: Cap Semi)
C9  value 4.7uF  PackageReference: 0805  Rating: X7R >=6.3v  [CAPC2012N]  (hidden comment: Cap Semi)
C36  value 0.1uF  PackageReference: 0402  Rating: X7R >=6.3v  [CAPC1005N]  (hidden comment: Cap Semi)
C46  value 0.1uF  PackageReference: 0402  Rating: X7R >=6.3v  [CAPC1005N]  (hidden comment: Cap Semi)
C47  value 0.1uF  PackageReference: 0402  [CAPC1005N]  (hidden comment: Cap Semi)
C50  value 0.1uF  PackageReference: 0402  [CAPC1005N]  (hidden comment: Cap Semi)
C52  value 0.1uF  PackageReference: 0402  Rating: X7R >=6.3v  [CAPC1005N]  (hidden comment: Cap Semi)
C53  value 0.1uF  PackageReference: 0402  Rating: X7R >=6.3v  [CAPC1005N]  (hidden comment: Cap Semi)
C54  value 0.1uF  PackageReference: 0402  Rating: X7R >=6.3v  [CAPC1005N]  (hidden comment: Cap Semi)
C55  value 0.1uF  PackageReference: 0402  Rating: X7R >=6.3v  [CAPC1005N]  (hidden comment: Cap Semi)
C56  value 0.1uF  PackageReference: 0402  Rating: X7R >=6.3v  [CAPC1005N]  (hidden comment: Cap Semi)
C57  value 0.1uF  PackageReference: 0402  Rating: X7R >=6.3v  [CAPC1005N]  (hidden comment: Cap Semi)
C58  value 0.1uF  PackageReference: 0402  Rating: X7R >=6.3v  [CAPC1005N]  (hidden comment: Cap Semi)
C60  value 18pF  PackageReference: 0603  [CAPC1608N]  (hidden comment: Cap Semi)
C61  value 18pF  PackageReference: 0603  [CAPC1608N]  (hidden comment: Cap Semi)
J1  value 61729-1011BLF  [1-1470156]  (hidden comment: 1-1470156-1)
L3  ferrite bead  PackageReference: 1206  [INDC3216AN]
L4  ferrite bead  PackageReference: 1206  [INDC3216AN]
NT2  Net Tie2  [NetTie 0603]  (value not drawn)  (net tie, no BOM)
NT3  Net Tie2  [NetTie 0603]  (value not drawn)  (net tie, no BOM)
NT4  Net Tie2  [NetTie 0603]  (value not drawn)  (net tie, no BOM)
NT5  Net Tie2  [NetTie 0603]  (value not drawn)  (net tie, no BOM)
P3  Header 17X2  [HDR2X17]  (no BOM)
R11  value 10K  PackageReference: 0603  [RESC1608N]  (hidden comment: Res Semi)
R12  value 10K  PackageReference: 0603  [RESC1608N]  (hidden comment: Res Semi)
R13  value 10K  PackageReference: 0603  [RESC1608N]  (hidden comment: Res Semi)
R15  value 12K 1%  PackageReference: 0603  [RESC1608N]  (hidden comment: Res Semi)
R16  value 2.2K  PackageReference: 0603  [RESC1608N]  (hidden comment: Res Semi)
R17  value 2.2K  PackageReference: 0603  [RESC1608N]  (hidden comment: Res Semi)
R18  value 330  PackageReference: 0603  [RESC1608N]  (hidden comment: Res Semi)
R19  value 10K  PackageReference: 0603  [RESC1608N]  (hidden comment: Res Semi)
R20  value 10K  PackageReference: 0603  [RESC1608N]  (hidden comment: Res Semi)
R21  value 10K  PackageReference: 0603  [RESC1608N]  (hidden comment: Res Semi)
R22  value 33  PackageReference: 0603  [RESC1608N]  (hidden comment: Res Semi)
R23  value 33  PackageReference: 0603  [RESC1608N]  (hidden comment: Res Semi)
U7  Component_1  [SQFP50P1200X1200X180-64N]  (value not drawn)
U8  M93C46WMN1  Supplier Part Number 1: 556-A93C46DNSH-B  [SOP8_N]
Y2  12MHz  Supplier Part Number 1: XC1289CT-ND  [HC49/4H_SMX]

### Nets
+1.8v: C36.2 C52.2 C53.2 C54.2 U7.12(Vcore) U7.37(Vcore) U7.49(VregOut) U7.64(Vcore)
+3.3v: C55.2 C56.2 C57.2 C58.2 L3.1 L4.1 R11.2 R12.2 R13.2 R16.1 R18.2 R19.1 R20.1 U7.20(VccIO) U7.31(VccIO) U7.42(VccIO) U7.50(VregIn) U7.56(VccIO) U8.6(ORG) U8.8(VCC)
GND: C8.1 C9.1 C36.1 C46.1 C47.1 C50.1 C52.1 C53.1 C54.1 C55.1 C56.1 C57.1 C58.1 C60.1 C61.1 J1.4(GND) J1.5(SHLD) J1.6(SHLD) P3.33 P3.34 R15.2 R21.1 U7.1(Gnd) U7.5(Gnd) U7.10(Agnd) U7.11(Gnd) U7.13(TEST) U7.15(Gnd) U7.25(Gnd) U7.35(Gnd) U7.47(Gnd) U7.51(Gnd) U8.5(GND)
Vusb: C46.2 J1.1(VBUS)
ACBUS0: P3.9 U7.26(ACBUS0)
ACBUS2: P3.11 U7.28(ACBUS2)
ACBUS3: P3.12 U7.29(ACBUS3)
ACBUS4: P3.13 U7.30(ACBUS4)
ACBUS6: P3.15 U7.33(ACBUS6)
ACBUS7: P3.16 U7.34(ACBUS7)
BCBUS4: P3.29 U7.55(BCBUS4)
BDBUS4: P3.21 U7.43(BDBUS4)
BDBUS5: P3.22 U7.44(BDBUS5)
BDBUS6: P3.23 U7.45(BDBUS6)
BDBUS7: P3.24 U7.46(BDBUS7)
CCLK: P3.10 R22.2
CLKOUT: P3.14 R23.2
CSI_B: P3.25 U7.48(BCBUS0)
D0: P3.1 U7.16(ADBUS0)
D1: P3.2 U7.17(ADBUS1)
D2: P3.3 U7.18(ADBUS2)
D3: P3.4 U7.19(ADBUS3)
D4: P3.5 U7.21(ADBUS4)
D5: P3.6 U7.22(ADBUS5)
D6: P3.7 U7.23(ADBUS6)
D7: P3.8 U7.24(ADBUS7)
DONE: P3.27 R18.1 U7.53(BCBUS2)
EECLK: R12.1 U7.62(EECLK) U8.2(SCL)
EECS: R13.1 U7.63(EECS) U8.1(CS)
EEDATA: R11.1 R17.2 U7.61(EEDATA) U8.3(D)
FTDI_TCK: NT2.1 P3.17 U7.38(BDBUS0)
FTDI_TDI: NT3.1 P3.18 U7.39(BDBUS1)
FTDI_TDO: NT4.1 P3.19 U7.40(BDBUS2)
FTDI_TMS: NT5.1 P3.20 U7.41(BDBUS3)
INIT_B: P3.30 R20.2 U7.57(BCBUS5)
M0: P3.31 U7.58(BCBUS6)
M1: P3.32 U7.59(BCBUS7)
OSCI: C60.2 U7.2(OSCI) Y2.1(OSC1)
OSCO: C61.2 U7.3(OSCO) Y2.2(OSC2)
PROG: P3.28 R19.2 U7.54(BCBUS3)
RAM~{_RA}S_HSWAPEN: R21.2
RDWR_B: P3.26 U7.52(BCBUS1)
TCK: NT2.2
TDI: NT3.2
TDO: NT4.2
TMS: NT5.2
USB_N: J1.2(D-) U7.7(DM)
USB_P: J1.3(D+) U7.8(DP)
Vphy: C9.2 C47.2 L4.2 U7.4(Vphy)
Vpll: C8.2 C50.2 L3.2 U7.9(Vpll)
NetR15_1: R15.1 U7.6(REF)
NetR16_2: R16.2 U7.14(RESET#)
NetR17_1: R17.1 U8.4(Q)
NetR22_1: R22.1 U7.27(ACBUS1)
NetR23_1: R23.1 U7.32(ACBUS5)

Not connected (* = marked no-connect by the designer): U7 36(SUSPEND#) 60(PWREN#); U8 7(DU)

### Layout directives
net class power: +1.8v, +3.3v, Vphy, Vpll
differential pair: USB_N, USB_P

### Notes on the sheet
- Inspired by http://www.ftdichip.com/Documents/DataSheets/DS_FT2232H_V206.pdf page 47
- (near R22) Configuration / FIFO to FPGA
- (near P3) Signals used during FPGA configuration (see XAPP502):
  D0-D7
  CSI_B, RDWR_B, CCLK, PROG_B, DONE, INIT_B, M0, M1
  Additional signals used during FIFO mode:
  ACBUS0 (RXF#)
  ACBUS2 (RD#)
  ACBUS3 (WR#)
  ACBUS5 (CLKOUT)
  ACBUS6 (OE#)
  spare I/Os:
- (near R18) Pulls per UG380 p34
- (near U7) Copyrights: CC-BY-SA 3.0
- (near NT5) Patents: Apache 2.0
- (in symbol Net Tie2) NT

### Library data of the parts
C8 C9 = Cap: Capacitor; Description: CAP CER 4.7UF 10V Y5V 0805; Tolerance: -20%, +80%; Substitutable: yes; Supplier 1: Digi-Key; Supplier Part Number 1: 445-1370-1-ND
C36 C46 C52-C58 = Cap Semi: as C2 on sheet FPGA power v3; Supplier 1: Digi-Key; Supplier Part Number 1: 445-4703-1-ND; Supplier 2: Digi-Key; Supplier Part Number 2: 445-6854-1-ND
C47 C50 = Cap Semi: Capacitor (Semiconductor SIM Model); Description: CAP CER 0.1UF 25V 10% X5R 0603; Tolerance: ±10%; Rating: X7R >=6.3v; Substitutable: yes; Supplier 1: Digi-Key; Supplier Part Number 1: 445-4703-1-ND; Supplier 2: Digi-Key; Supplier Part Number 2: 445-6854-1-ND
C60 C61 = Cap Semi: as C62 on sheet RAM and target USB; Supplier 1: Digi-Key; Supplier Part Number 1: 445-1777-1-ND
J1 = 1-1470156-1: as J2 on sheet RAM and target USB; PackageReference: 1-1470156
L3 L4 = Inductor: VALUE: 0; Substitutable: yes; Supplier 1: Mouser; Supplier Part Number 1: 81-BLM18KG121TN1D
NT2-NT5 = Net Tie2: as NT1 on sheet RAM and target USB
P3 = Header 17X2: Header, 17-Pin, Dual row; Substitutable: DNP
R11-R13 R16-R23 = Res Semi: as R4 on sheet RAM and target USB
  R11-R13 R19-R21: Supplier 1: Digi-Key; Supplier Part Number 1: P10KGCT-ND
  R16 R17: Supplier 1: Digi-Key; Supplier Part Number 1: P2.2KGCT-ND
R15 = Res Semi: Semiconductor Resistor; Rating: 1%; Substitutable: yes; Supplier 1: Digi-Key; Supplier Part Number 1: P12.0KHCT-ND
U7 = Component_1: FT2232H; Substitutable: no; Supplier 1: Mouser; Supplier Part Number 1: 895-FT2232HL; PackageReference: QFP-64; Value: FT2232H
U8 = M93C46WMN1: 1Kb (x8/x16) Serial Microwire Bus EEPROM; Substitutable: no; PackageReference: SOP8; Supplier 1: Mouser; Value: M93C46WMN1
Y2 = XTAL: Crystal Oscillator; Substitutable: yes; PackageReference: HS-49; Value: 12 MHz; Supplier 1: Digi-Key

## Nets that join several sheets
+1.2v: power (L5.1 TP2.1), FPGA power v3 (10 pins), fpga (P4.23)
+3.3v: power (C17.2 TP1.1 U9.2 U9.4), FPGA power v3 (37 pins), RAM and target USB (17 pins), fpga (9 pins), usb (20 pins)
+5v: power (7 pins), fpga (P4.24)
GND: power (15 pins), FPGA power v3 (39 pins), RAM and target USB (29 pins), fpga (18 pins), usb (33 pins)
targetVBUS: power (D2.2), RAM and target USB (9 pins)
Vusb: power (D1.2), usb (C46.2 J1.1)
ACBUS0: fpga (U2.55), usb (P3.9 U7.26)
ACBUS2: fpga (U2.41), usb (P3.11 U7.28)
ACBUS3: fpga (U2.40), usb (P3.12 U7.29)
ACBUS4: fpga (TP15.1 U2.66), usb (P3.13 U7.30)
ACBUS6: fpga (U2.38), usb (P3.15 U7.33)
CCLK: fpga (U2.70), usb (P3.10 R22.2)
CLKOUT: fpga (U2.51), usb (P3.14 R23.2)
CSI_B: fpga (U2.64), usb (P3.25 U7.48)
D0: fpga (U2.65), usb (P3.1 U7.16)
D1: fpga (U2.62), usb (P3.2 U7.17)
D2: fpga (U2.61), usb (P3.3 U7.18)
D3: fpga (U2.46), usb (P3.4 U7.19)
D4: fpga (U2.45), usb (P3.5 U7.21)
D5: fpga (U2.44), usb (P3.6 U7.22)
D6: fpga (U2.43), usb (P3.7 U7.23)
D7: fpga (U2.48), usb (P3.8 U7.24)
DONE: fpga (U2.71), usb (P3.27 R18.1 U7.53)
INIT_B: fpga (U2.39), usb (P3.30 R20.2 U7.57)
M0: fpga (U2.69), usb (P3.31 U7.58)
M1: fpga (U2.60), usb (P3.32 U7.59)
OSCO: fpga (R3.1), usb (C61.2 U7.3 Y2.2)
PROG: fpga (U2.37), usb (P3.28 R19.2 U7.54)
RAM~{_CA}S: RAM and target USB (U3.17), fpga (U2.143)
RAM~{_CS}0: RAM and target USB (U3.19), fpga (U2.1)
RAM~{_RA}S_HSWAPEN: RAM and target USB (U3.18), fpga (U2.144), usb (R21.2)
RAM_A0: RAM and target USB (U3.23), fpga (U2.7)
RAM_A1: RAM and target USB (U3.24), fpga (U2.8)
RAM_A2: RAM and target USB (U3.25), fpga (U2.9)
RAM_A3: RAM and target USB (U3.26), fpga (U2.10)
RAM_A4: RAM and target USB (U3.29), fpga (U2.35)
RAM_A5: RAM and target USB (U3.30), fpga (U2.34)
RAM_A6: RAM and target USB (U3.31), fpga (U2.33)
RAM_A7: RAM and target USB (U3.32), fpga (U2.32)
RAM_A8: RAM and target USB (U3.33), fpga (U2.30)
RAM_A9: RAM and target USB (U3.34), fpga (U2.29)
RAM_A10: RAM and target USB (U3.22), fpga (U2.6)
RAM_A11: RAM and target USB (U3.35), fpga (U2.27)
RAM_A12: RAM and target USB (U3.36), fpga (U2.26)
RAM_BA0: RAM and target USB (U3.20), fpga (U2.2)
RAM_BA1: RAM and target USB (U3.21), fpga (U2.5)
RAM_CKE: RAM and target USB (U3.37), fpga (U2.56)
RAM_CLK: RAM and target USB (NT1.1), fpga (U2.24)
RAM_D0: RAM and target USB (U3.2), fpga (U2.131)
RAM_D1: RAM and target USB (U3.4), fpga (U2.132)
RAM_D2: RAM and target USB (U3.5), fpga (U2.133)
RAM_D3: RAM and target USB (U3.7), fpga (U2.134)
RAM_D4: RAM and target USB (U3.8), fpga (U2.137)
RAM_D5: RAM and target USB (U3.10), fpga (U2.138)
RAM_D6: RAM and target USB (U3.11), fpga (U2.139)
RAM_D7: RAM and target USB (U3.13), fpga (U2.140)
RAM_D8: RAM and target USB (U3.42), fpga (U2.22)
RAM_D9: RAM and target USB (U3.44), fpga (U2.21)
RAM_D10: RAM and target USB (U3.45), fpga (U2.17)
RAM_D11: RAM and target USB (U3.47), fpga (U2.16)
RAM_D12: RAM and target USB (U3.48), fpga (U2.15)
RAM_D13: RAM and target USB (U3.50), fpga (U2.14)
RAM_D14: RAM and target USB (U3.51), fpga (U2.12)
RAM_D15: RAM and target USB (U3.53), fpga (U2.11)
RAM_DQMH: RAM and target USB (U3.39), fpga (U2.23)
RAM_DQML: RAM and target USB (U3.15), fpga (U2.141)
RAM_WE#: RAM and target USB (U3.16), fpga (U2.142)
RDWR_B: fpga (U2.47), usb (P3.26 U7.52)
target1ULPI_CLK: RAM and target USB (P2.4 U4.2), fpga (U2.123)
target1ULPI_D0: RAM and target USB (P2.6 U4.4), fpga (U2.120)
target1ULPI_D1: RAM and target USB (P2.7 U4.5), fpga (U2.119)
target1ULPI_D2: RAM and target USB (P2.8 U4.6), fpga (U2.118)
target1ULPI_D3: RAM and target USB (P2.9 U4.7), fpga (U2.117)
target1ULPI_D4: RAM and target USB (P2.10 U4.8), fpga (U2.116)
target1ULPI_D5: RAM and target USB (P2.11 U4.10), fpga (U2.115)
target1ULPI_D6: RAM and target USB (P2.12 U4.11), fpga (U2.114)
target1ULPI_D7: RAM and target USB (P2.13 U4.12), fpga (U2.112)
target1ULPI_DIR: RAM and target USB (P2.3 U4.1), fpga (U2.124)
target1ULPI_NXT: RAM and target USB (P2.5 U4.3), fpga (U2.121)
target1ULPI_RST: RAM and target USB (P2.1 U4.22), fpga (U2.127)
target1ULPI_STP: RAM and target USB (P2.2 U4.24), fpga (U2.126)
targetDtap_N: RAM and target USB (R4.2), fpga (U2.104)
targetDtap_P: RAM and target USB (R5.2), fpga (U2.105)
TCK: fpga (P1.4 U2.109), usb (NT2.2)
TDI: fpga (P1.7 U2.110), usb (NT3.2)
TDO: fpga (P1.6 U2.106), usb (NT4.2)
TMS: fpga (P1.9 U2.107), usb (NT5.2)